# Altium schematic sheet Main.SchDoc
size A
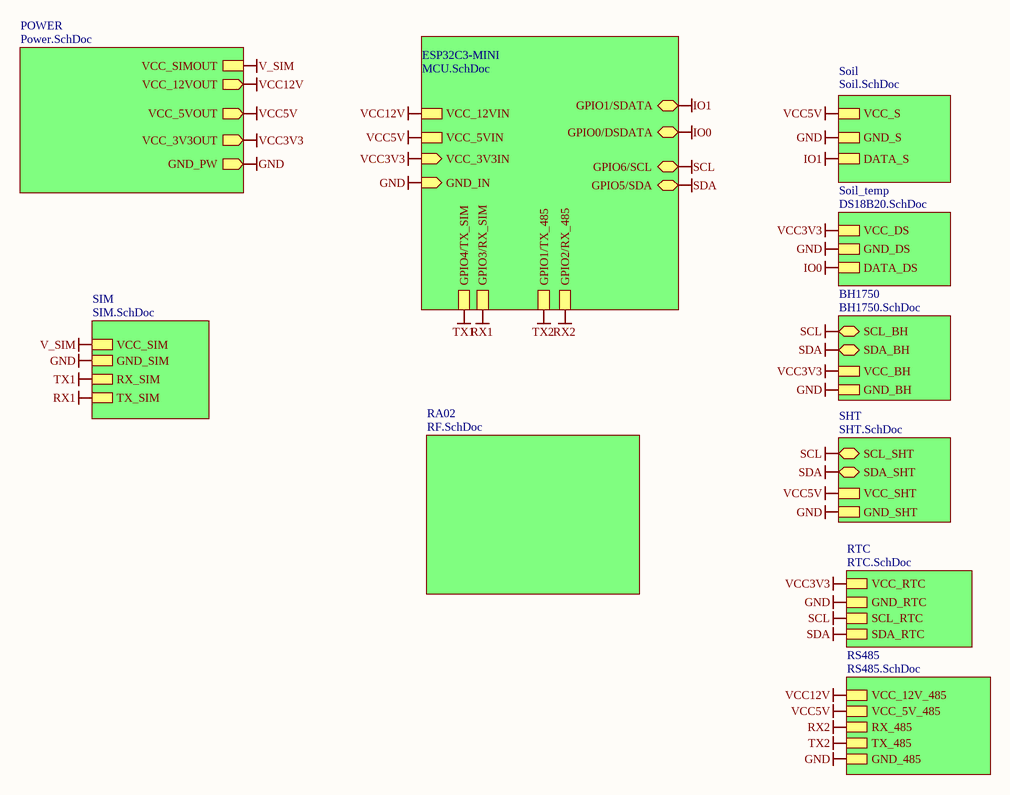
[diagram p0: Main.SchDoc]

## Sub-sheets
BH1750 = BH1750.SchDoc: SCL_BH (bidir), SDA_BH (bidir), VCC_BH, GND_BH
ESP32C3-MINI = MCU.SchDoc: VCC_3V3IN (in), GND_IN (in), GPIO1/SDATA (bidir), GPIO0/DSDATA (bidir), GPIO6/SCL (bidir), GPIO5/SDA (bidir), VCC_5VIN, VCC_12VIN, GPIO4/TX_SIM, GPIO3/RX_SIM, GPIO1/TX_485, GPIO2/RX_485
POWER = Power.SchDoc: VCC_12VOUT (out), VCC_5VOUT (out), VCC_3V3OUT (out), GND_PW (out), VCC_SIMOUT
RA02 = RF.SchDoc: no entries
RS485 = RS485.SchDoc: VCC_12V_485, VCC_5V_485, RX_485, TX_485, GND_485
RTC = RTC.SchDoc: VCC_RTC, GND_RTC, SCL_RTC, SDA_RTC
SHT = SHT.SchDoc: SCL_SHT (bidir), SDA_SHT (bidir), VCC_SHT, GND_SHT
SIM = SIM.SchDoc: VCC_SIM, GND_SIM, RX_SIM, TX_SIM
Soil = Soil.SchDoc: VCC_S, GND_S, DATA_S
Soil_temp = DS18B20.SchDoc: VCC_DS, GND_DS, DATA_DS

## Nets
GND: sheet ESP32C3-MINI/GND_IN, sheet POWER/GND_PW, sheet RTC/GND_RTC, sheet Soil/GND_S, sheet Soil_temp/GND_DS, sheet BH1750/GND_BH, sheet SHT/GND_SHT, sheet SIM/GND_SIM, sheet RS485/GND_485
IO0: sheet ESP32C3-MINI/GPIO0/DSDATA, sheet Soil_temp/DATA_DS
IO1: sheet ESP32C3-MINI/GPIO1/SDATA, sheet Soil/DATA_S
RX1: sheet ESP32C3-MINI/GPIO3/RX_SIM, sheet SIM/TX_SIM
RX2: sheet ESP32C3-MINI/GPIO2/RX_485, sheet RS485/RX_485
SCL: sheet ESP32C3-MINI/GPIO6/SCL, sheet RTC/SCL_RTC, sheet BH1750/SCL_BH, sheet SHT/SCL_SHT
SDA: sheet ESP32C3-MINI/GPIO5/SDA, sheet RTC/SDA_RTC, sheet BH1750/SDA_BH, sheet SHT/SDA_SHT
TX1: sheet ESP32C3-MINI/GPIO4/TX_SIM, sheet SIM/RX_SIM
TX2: sheet ESP32C3-MINI/GPIO1/TX_485, sheet RS485/TX_485
V_SIM: sheet POWER/VCC_SIMOUT, sheet SIM/VCC_SIM
VCC3V3: sheet ESP32C3-MINI/VCC_3V3IN, sheet POWER/VCC_3V3OUT, sheet RTC/VCC_RTC, sheet Soil_temp/VCC_DS, sheet BH1750/VCC_BH
VCC5V: sheet ESP32C3-MINI/VCC_5VIN, sheet POWER/VCC_5VOUT, sheet Soil/VCC_S, sheet SHT/VCC_SHT, sheet RS485/VCC_5V_485
VCC12V: sheet ESP32C3-MINI/VCC_12VIN, sheet POWER/VCC_12VOUT, sheet RS485/VCC_12V_485